# EAGLE schematic GroundStationOBA (EAGLE 7.3.0)
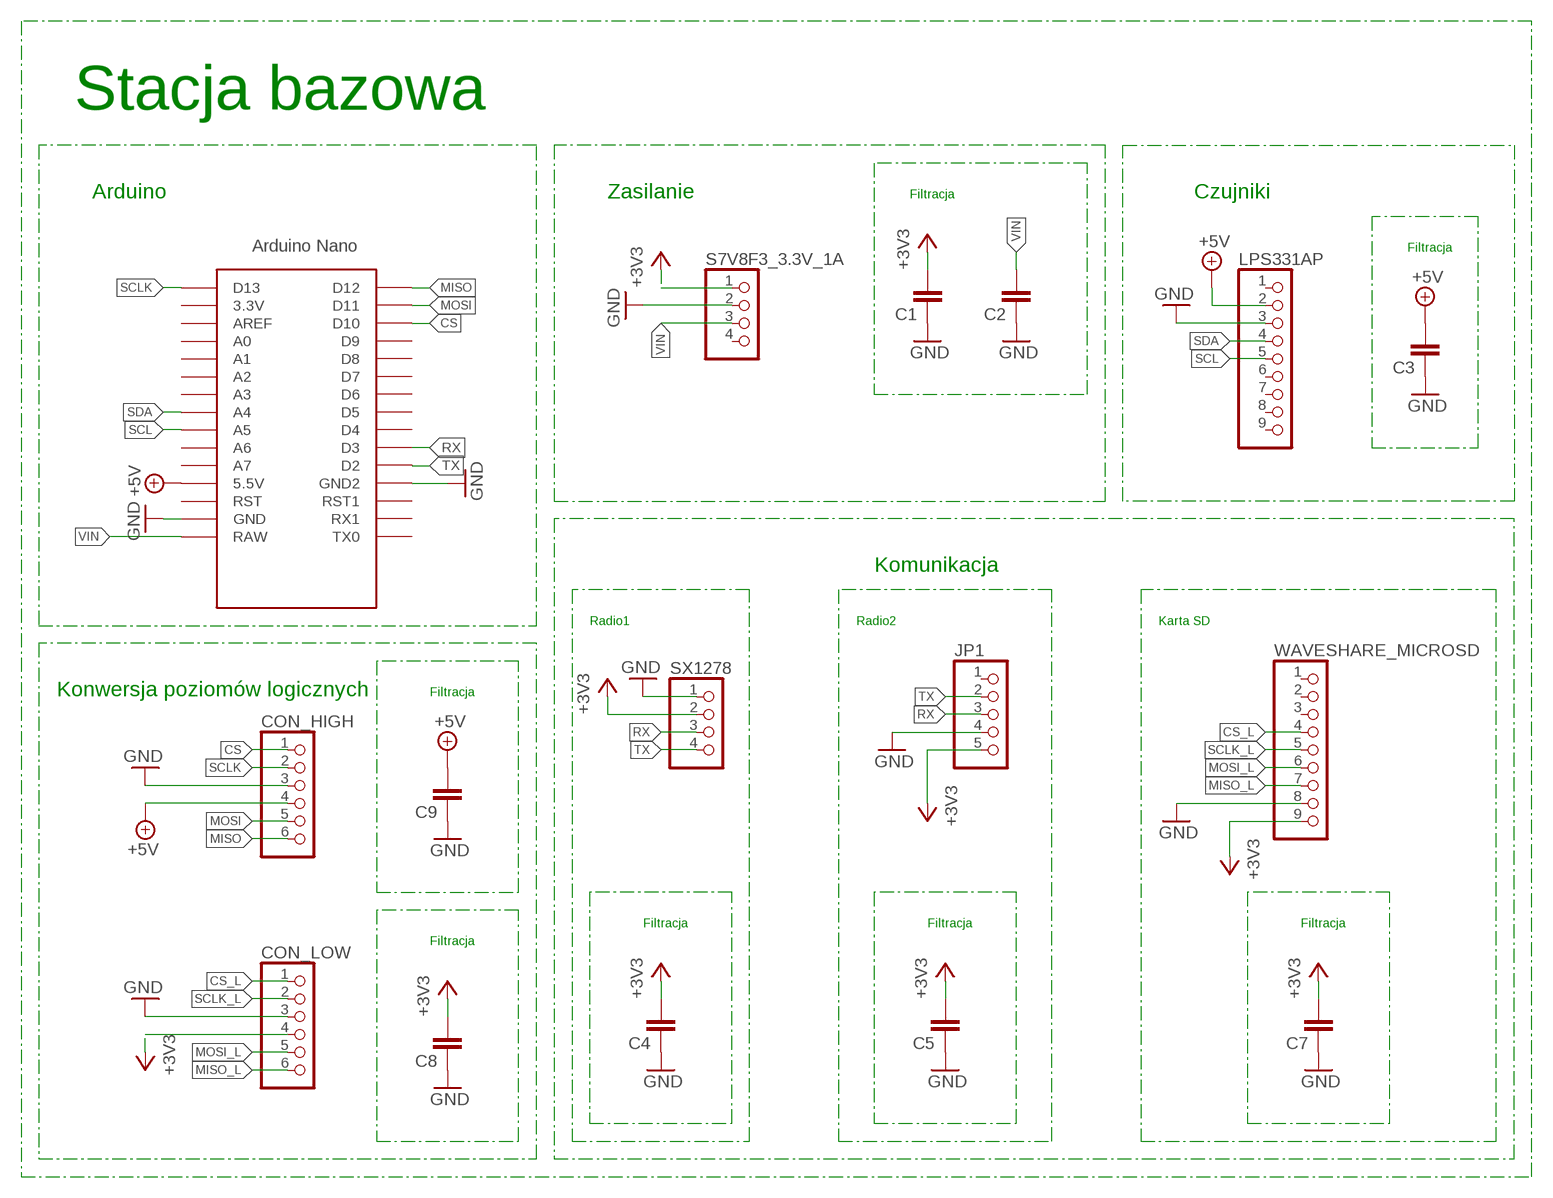
[diagram p0: schematic, sheet 1]

## Parts
C1  C-EU050-025X075  [C050-025X075]
C2  C-EU050-025X075  [C050-025X075]
C3  C-EU050-025X075  [C050-025X075]
C4  C-EU050-025X075  [C050-025X075]
C5  C-EU050-025X075  [C050-025X075]
C7  C-EU050-025X075  [C050-025X075]
C8  C-EU050-025X075  [C050-025X075]
C9  C-EU050-025X075  [C050-025X075]
CON_HIGH  PINHD-1X6  [1X06]
CON_LOW  PINHD-1X6  [1X06]
JP1  PINHD-1X5  [1X05]
LPS331AP  PINHD-1X9  [1X09]
S7V8F3_3.3V_1A  PINHD-1X4  [1X04]
SX1278  PINHD-1X4  [1X04]
U$1  NANO  [NANO]
WAVESHARE_MICROSD  PINHD-1X9  [1X09]

## Nets
+3V3: C1.2 C4.2 C5.2 C7.2 C8.2 CON_LOW.4 JP1.5 S7V8F3_3.3V_1A.1 SX1278.2 WAVESHARE_MICROSD.9
+5V: C3.2 C9.2 CON_HIGH.4 LPS331AP.2 U$1.5V(5.5V)
CS: CON_HIGH.1 U$1.D10
CS_L: CON_LOW.1 WAVESHARE_MICROSD.4
GND: C1.1 C2.1 C3.1 C4.1 C5.1 C7.1 C8.1 C9.1 CON_HIGH.3 CON_LOW.3 JP1.4 LPS331AP.3 S7V8F3_3.3V_1A.2 SX1278.1 U$1.GND U$1.GND1(GND2) WAVESHARE_MICROSD.8
MISO: CON_HIGH.6 U$1.D12
MISO_L: CON_LOW.6 WAVESHARE_MICROSD.7
MOSI: CON_HIGH.5 U$1.D11
MOSI_L: CON_LOW.5 WAVESHARE_MICROSD.6
RX: JP1.3 SX1278.3 U$1.D3
SCL: LPS331AP.5 U$1.A5
SCLK: CON_HIGH.2 U$1.D13
SCLK_L: CON_LOW.2 WAVESHARE_MICROSD.5
SDA: LPS331AP.4 U$1.A4
TX: JP1.2 SX1278.4 U$1.D2
VIN: C2.2 S7V8F3_3.3V_1A.3 U$1.RAW
Unconnected: JP1.1 LPS331AP.1 LPS331AP.6 LPS331AP.7 LPS331AP.8 LPS331AP.9 S7V8F3_3.3V_1A.4 U$1.3.3V U$1.A0 U$1.A1 U$1.A2 U$1.A3 U$1.A6 U$1.A7 U$1.AREF U$1.D4 U$1.D5 U$1.D6 U$1.D7 U$1.D8 U$1.D9 U$1.ICSP1 U$1.ICSP2 U$1.ICSP3 U$1.ICSP4 U$1.ICSP5 U$1.ICSP6 U$1.RST U$1.RST1 U$1.RX1 U$1.TX0 WAVESHARE_MICROSD.1 WAVESHARE_MICROSD.2 WAVESHARE_MICROSD.3

## Notes on the sheet
- Stacja bazowa
- Arduino | Zasilanie | Filtracja | Czujniki
- Filtracja
- Komunikacja
- Radio1 | Radio2 | Karta SD
- Konwersja poziomów logicznych | Filtracja
- Filtracja | Filtracja | Filtracja
- Filtracja

## Library data of the parts
C1-C5 C7-C9 = resistor:C-EU: CAPACITOR, European symbol
CON_HIGH CON_LOW = pinhead:PINHD-1X6: PIN HEADER
JP1 = pinhead:PINHD-1X5: PIN HEADER
LPS331AP WAVESHARE_MICROSD = pinhead:PINHD-1X9: PIN HEADER
S7V8F3_3.3V_1A SX1278 = pinhead:PINHD-1X4: PIN HEADER
U$1 = Arduino-clone:NANO: Arduino Nano